# EAGLE design at88g.v2 (EAGLE 4.16)
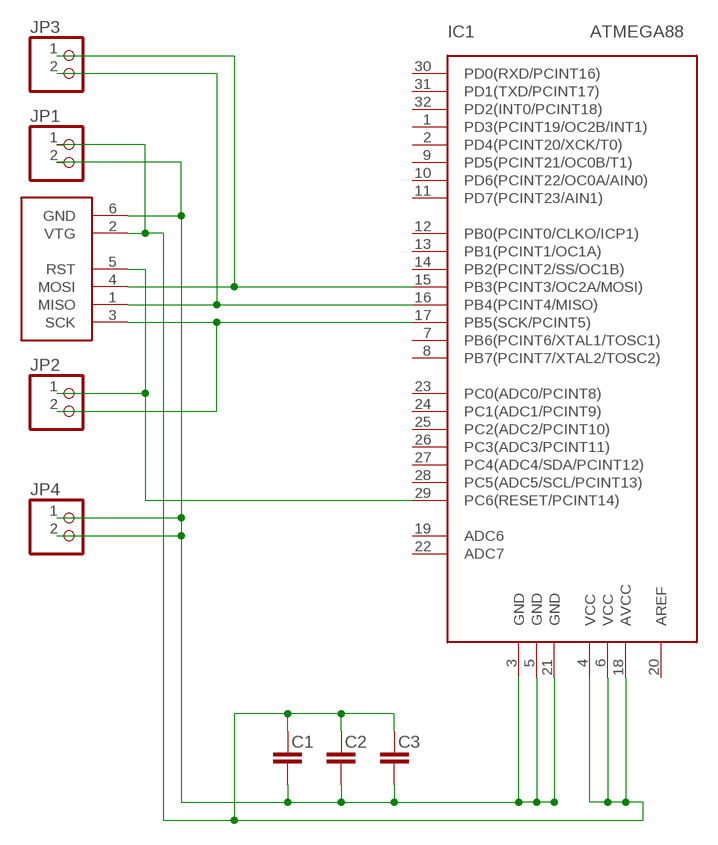
[diagram p0: schematic, sheet 1]

## Parts
C1  C-EU  [C0603]
C2  C-EU  [C0603]
C3  C-EU  [C0603]
IC1  ATMEGA88  [TQFP32]
JP1  PINHD-1X2  [1X02]
JP2  PINHD-1X2  [1X02]
JP3  PINHD-1X2  [1X02]
JP4  PINHD-1X2  [1X02]
X1  AVRISP6PIN  [6PIN]

## Nets
GND: C1.2 C2.2 C3.2 IC1.3(GND) IC1.5(GND) IC1.21(GND) JP1.2 JP4.1 JP4.2 X1.6(GND)
MISO: IC1.16(PB4(PCINT4/MISO)) JP3.2 X1.1(MISO)
MOSI: IC1.15(PB3(PCINT3/OC2A/MOSI)) JP3.1 X1.4(MOSI)
RST: IC1.29(PC6(RESET/PCINT14)) JP2.1 X1.5(RST)
SCK: IC1.17(PB5(SCK/PCINT5)) JP2.2 X1.3(SCK)
VCC: C1.1 C2.1 C3.1 IC1.4(VCC) IC1.6(VCC) IC1.18(AVCC) JP1.1 X1.2(VTG)
Unconnected: IC1.1(PD3(PCINT19/OC2B/INT1)) IC1.2(PD4(PCINT20/XCK/T0)) IC1.7(PB6(PCINT6/XTAL1/TOSC1)) IC1.8(PB7(PCINT7/XTAL2/TOSC2)) IC1.9(PD5(PCINT21/OC0B/T1)) IC1.10(PD6(PCINT22/OC0A/AIN0)) IC1.11(PD7(PCINT23/AIN1)) IC1.12(PB0(PCINT0/CLKO/ICP1)) IC1.13(PB1(PCINT1/OC1A)) IC1.14(PB2(PCINT2/SS/OC1B)) IC1.19(ADC6) IC1.20(AREF) IC1.22(ADC7) IC1.23(PC0(ADC0/PCINT8)) IC1.24(PC1(ADC1/PCINT9)) IC1.25(PC2(ADC2/PCINT10)) IC1.26(PC3(ADC3/PCINT11)) IC1.27(PC4(ADC4/SDA/PCINT12)) IC1.28(PC5(ADC5/SCL/PCINT13)) IC1.30(PD0(RXD/PCINT16)) IC1.31(PD1(TXD/PCINT17)) IC1.32(PD2(INT0/PCINT18))

## Library data of the parts
C1-C3 = rcl:C-EU
IC1 = atmega88:ATMEGA88
JP1-JP4 = pinhead-mm:PINHD-1X2: PIN HEADER
X1 = avrisp:AVRISP6PIN

## Board
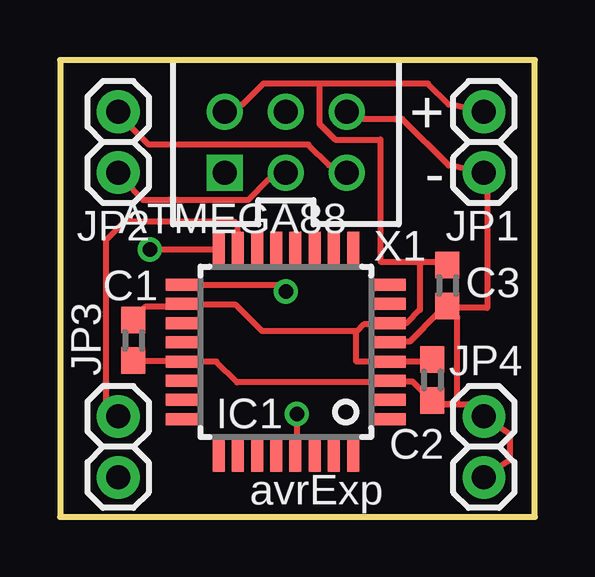
[diagram p1: board, top side]
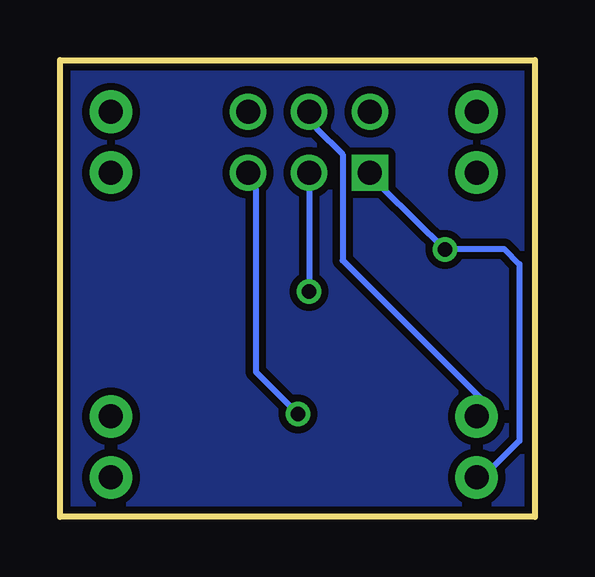
[diagram p2: board, bottom side, seen from below]

Size 19.79 x 19.04 mm. Coordinates in mm from the lower left corner, seen from the top.
Outline: 19.79,19.04 0,19.04 0,0 19.79,0 19.79,19.04
Copper layers (1*16): Top 0.035mm / dielectric 1.5mm / Bottom 0.035mm
Design rules "default": minimum track width 10mil, minimum drill 0.6mm, track to track 10mil, track to pad 10mil, pad to pad 10mil, via to via 10mil, smd to smd 10mil, copper to edge 10mil, drill to drill 10mil, minimum pad ring 10mil, minimum via ring 8mil, stop-mask expansion 4mil, vias tented up to drill 0mil, thermal gap 10mil

### Footprints (pad centres in the part's own frame; a part is rotated, then mirrored left to right if it is on the bottom)
C0603 = smd 1.1 x 1: 1 -0.85,0; 2 0.85,0
TQFP32 = smd 1.5 x 0.5: 1 -4.25,2.65; 2 -4.25,1.85; 3 -4.25,1.05; 4 -4.25,0.25; 5 -4.25,-0.55; 6 -4.25,-1.35; 7 -4.25,-2.15; 8 -4.25,-2.95; 17 4.25,-2.95; 18 4.25,-2.15; 19 4.25,-1.35; 20 4.25,-0.55; 21 4.25,0.25; 22 4.25,1.05; 23 4.25,1.85; 24 4.25,2.65 | smd 0.5 x 1.5: 9 -2.8,-4.4; 10 -2,-4.4; 11 -1.2,-4.4; 12 -0.4,-4.4; 13 0.4,-4.4; 14 1.2,-4.4; 15 2,-4.4; 16 2.8,-4.4; 25 2.8,4.1; 26 2,4.1; 27 1.2,4.1; 28 0.4,4.1; 29 -0.4,4.1; 30 -1.2,4.1; 31 -2,4.1; 32 -2.8,4.1
1X02 = drill 1 pad 1.778 round: 1 -1.27,0; 2 1.27,0
6PIN = drill 1 square: 1 -1.27,2.54 | drill 1 round: 2 1.27,2.54; 3 -1.27,0; 4 1.27,0; 5 -1.27,-2.54; 6 1.27,-2.54

### Placement (x,y rotation side)
C1  3.06,7.36 270 top
C2  15.51,5.71 270 top
C3  16.14,9.65 270 top
IC1  9.41,6.73 180 top
JP1  17.67,15.62 270 top
JP2  2.43,15.62 270 top
JP3  2.43,2.92 270 top
JP4  17.67,2.92 270 top
X1  9.41,15.62 90 top

### Tracks (layer width: path | path; a pad name or v marks a point on that pad's centre or on a via)
GND
  Top 0.254: X1.6 12.69,16.58 14.26,16.58 16.19,14.65 JP1.2 17.79,13.64 17.79,8.71 16.24,8.71 C3.2 | JP4.2 18.73,2.36 18.73,3.48 JP4.1 17.15,4.7 15.38,4.7 | IC1.5 14.06,7.31 14.57,7.31 15.79,8.53 C3.2 | C1.2 3.42,6.5 4.64,6.5 IC1.21 5.52,6.47 6.51,6.47 7.38,5.61 13.55,5.61 IC1.3 14.06,5.63 14.69,5.63 15.38,4.95 15.51,4.95 15.51,4.7 | 15.38,4.7 C2.2 | C3.2 16.23,8.42 16.52,8.38 16.52,4.69 15.51,4.7 | 15.38,4.7 15.38,4.69 | 15.38,4.7 | 15.51,4.7 15.38,4.7
GND0
  pour Bottom (isolate 0.305): 19.7,0 0.01,0 0.01,19.05 19.7,19.05
MISO  (via drill 0.6)
  Top 0.254: IC1.16 6.49,11.15 v3.75,11.15 3.72,11.17
  Bottom 0.254: X1.1 6.29,13.64 v3.75,11.15 3.8,11.15 3.82,11.17 1.28,11.17 0.65,10.54 0.65,3.17 2.17,1.65 JP3.2
MOSI
  Top 0.254: JP3.1 1.92,4.77 1.92,11.55 2.68,12.31 7.25,12.31 7.38,12.19 7.38,11.16 IC1.15
  Bottom 0.254: X1.4 9.08,16.17 8.01,15.11 8.01,10.69 2.22,4.9 JP3.1
RST  (via drill 0.6)
  Top 0.254: v9.87,4.29 9.87,2.89 IC1.29 | JP2.1 2.63,16.58 3.7,15.51 10.35,15.51 11.21,14.65 X1.5
  Bottom 0.254: v9.87,4.29 11.62,6.04 11.62,13.64 X1.5
SCK  (via drill 0.6)
  Top 0.254: JP2.2 2.63,14.04 3.47,13.2 7.84,13.2 8.67,14.04 X1.3 | IC1.17 5.19,9.65 9.28,9.65 9.54,9.39 v9.41,9.39
  Bottom 0.254: X1.3 v9.41,9.39
VCC
  Top 0.254: C1.1 3.54,8.76 4.76,8.76 IC1.18 5.52,8.83 7.33,8.83 8.42,7.74 12.33,7.74 12.36,7.72 | 12.36,7.72 12.33,7.69 12.33,6.5 13.3,6.5 IC1.4 14.06,6.5 15.28,6.5 C2.1 | 12.36,7.72 12.66,8.02 13.3,8.02 IC1.6 14.44,8.08 15,8.63 15,10.64 | 10.81,18.05 8.47,18.05 7.61,17.19 X1.2 | 10.81,18.05 15.33,18.05 16.19,17.19 JP1.1 | 15,10.64 13.35,10.64 13.35,15.72 11.47,15.72 10.81,16.38 10.81,18.05 | 15,10.64 15,10.66 | C3.1 16.23,10.5 16.27,10.54 16.17,10.64 15,10.64

### Text on the board
tPlace: + | - | avrExp